# Altium schematic sheet RK3566_Power.SchDoc
size A2; SheetNumber: 3; SheetTotal: 6
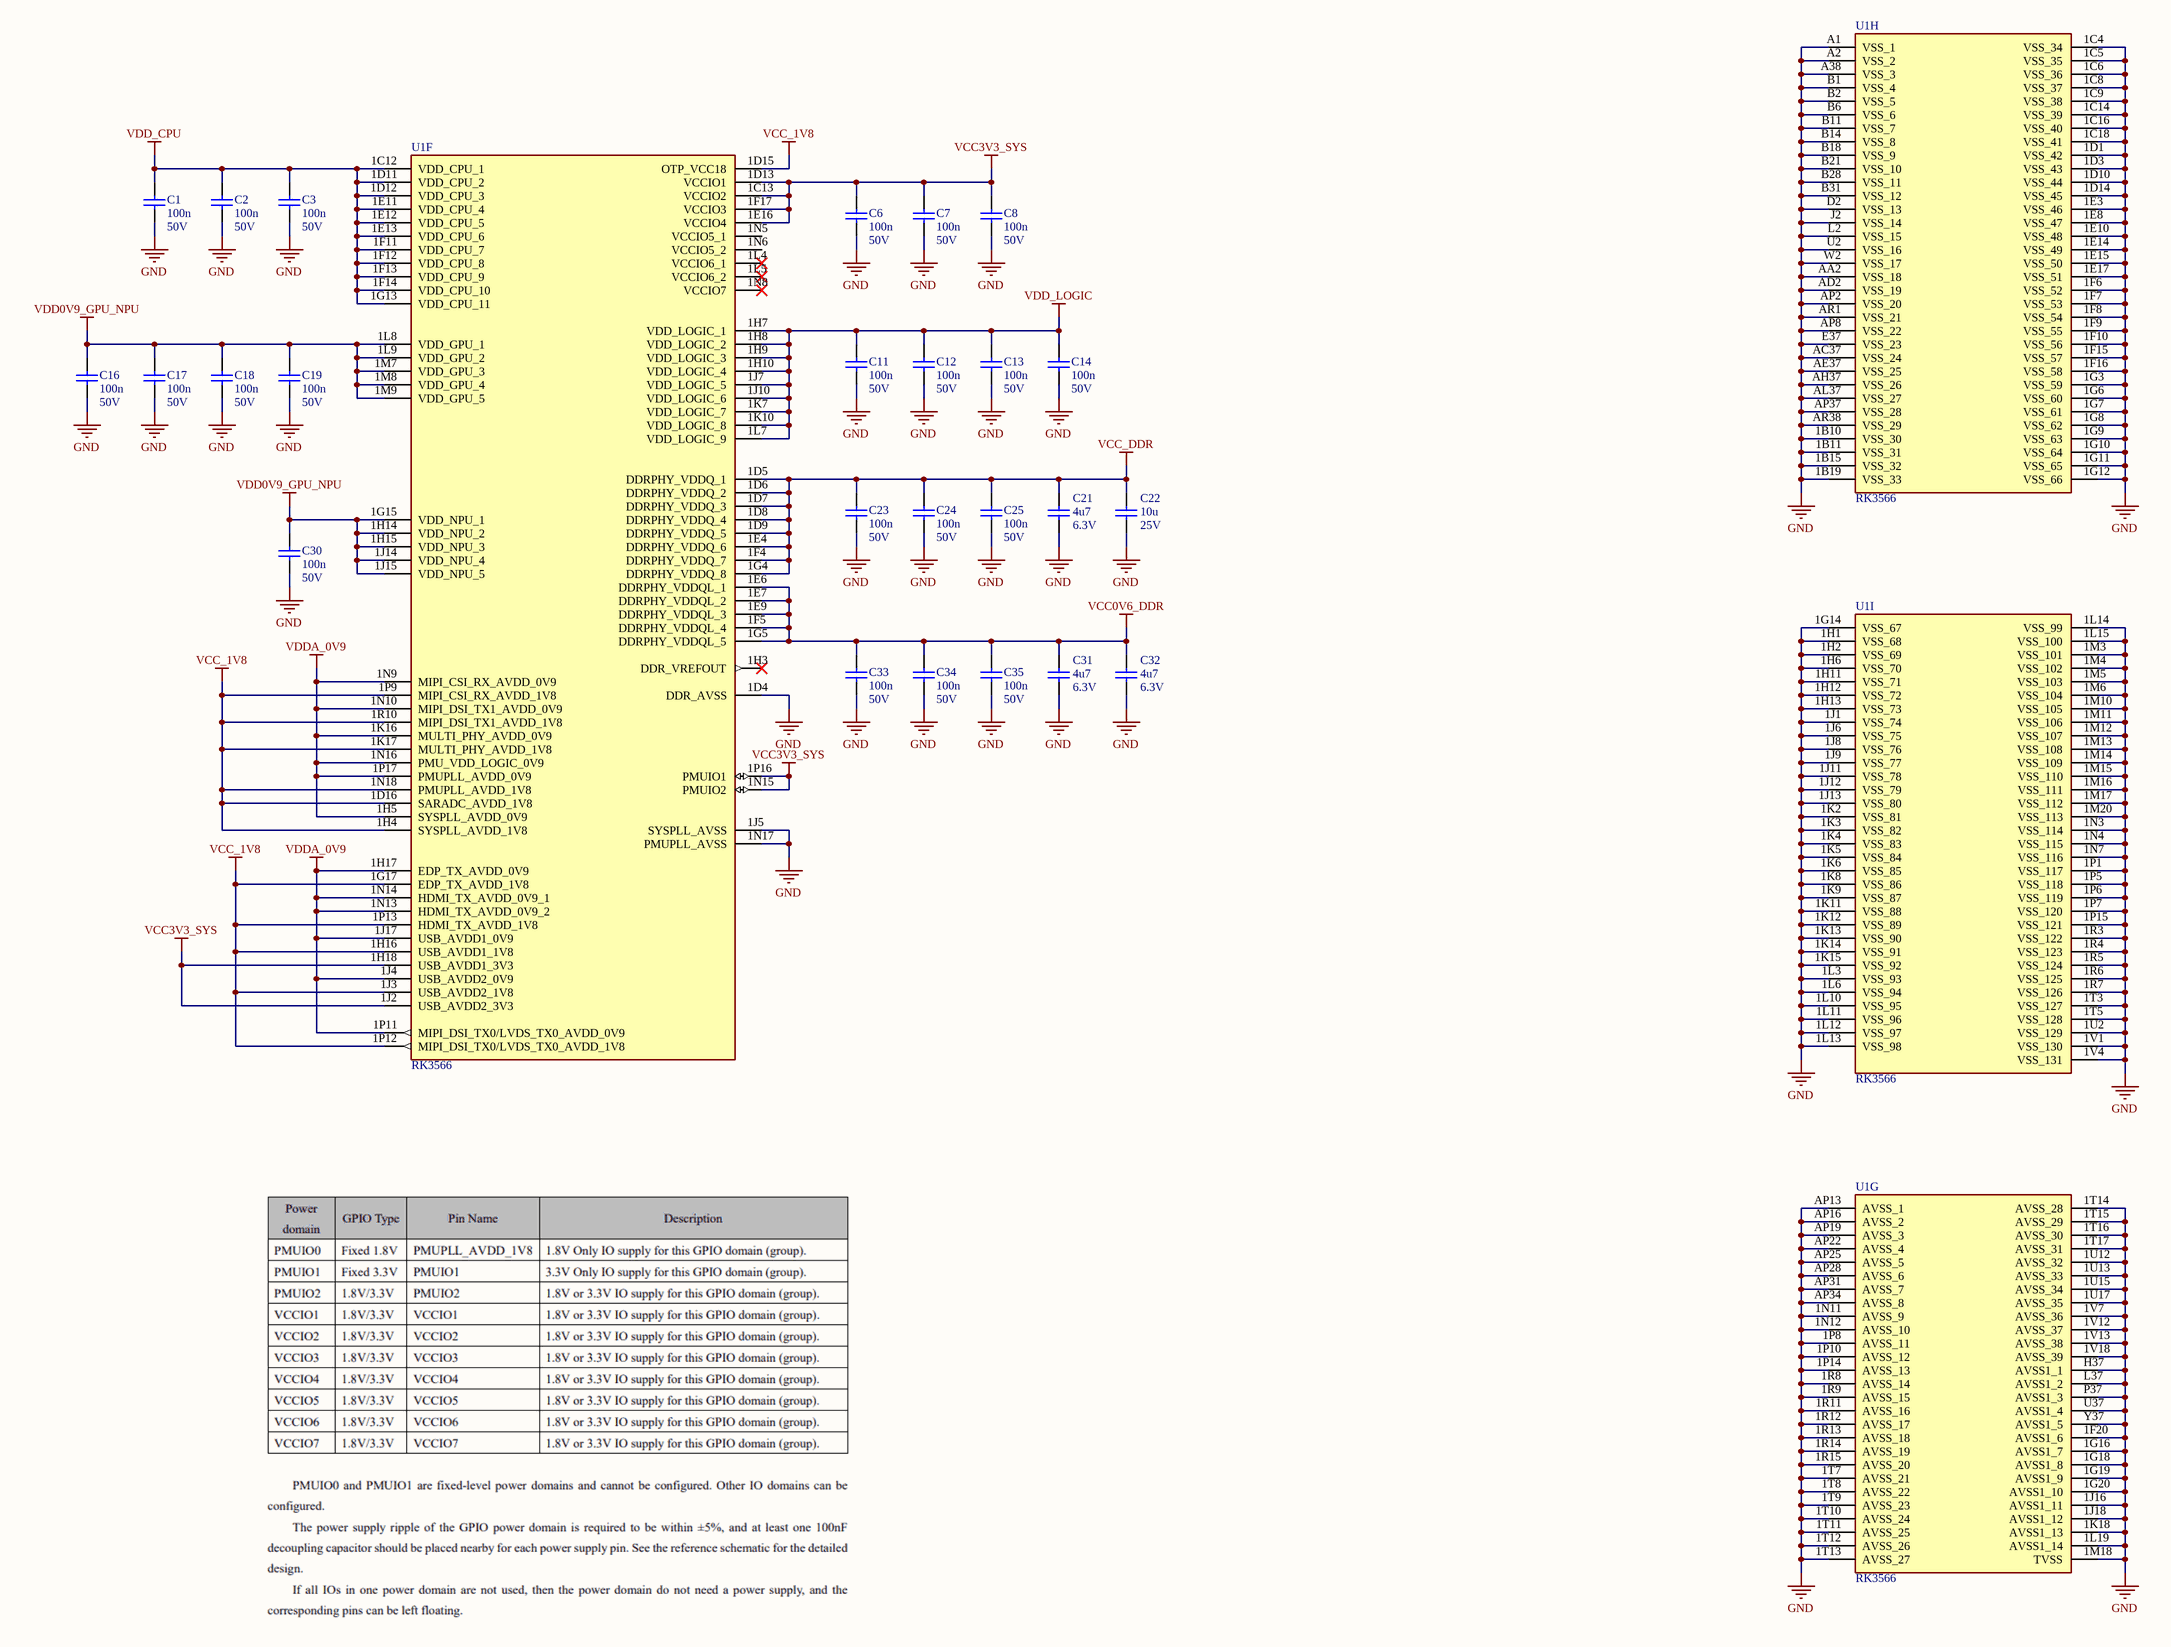
[diagram p0: RK3566_Power.SchDoc]

## Parts
C1  value 100n  Voltage: 50V  [GRM155R71H104KE14D]  (hidden comment: GRM155R71H104KE14D)
C2  value 100n  Voltage: 50V  [GRM155R71H104KE14D]  (hidden comment: GRM155R71H104KE14D)
C3  value 100n  Voltage: 50V  [GRM155R71H104KE14D]  (hidden comment: GRM155R71H104KE14D)
C6  value 100n  Voltage: 50V  [GRM155R71H104KE14D]  (hidden comment: GRM155R71H104KE14D)
C7  value 100n  Voltage: 50V  [GRM155R71H104KE14D]  (hidden comment: GRM155R71H104KE14D)
C8  value 100n  Voltage: 50V  [GRM155R71H104KE14D]  (hidden comment: GRM155R71H104KE14D)
C11  value 100n  Voltage: 50V  [GRM155R71H104KE14D]  (hidden comment: GRM155R71H104KE14D)
C12  value 100n  Voltage: 50V  [GRM155R71H104KE14D]  (hidden comment: GRM155R71H104KE14D)
C13  value 100n  Voltage: 50V  [GRM155R71H104KE14D]  (hidden comment: GRM155R71H104KE14D)
C14  value 100n  Voltage: 50V  [GRM155R71H104KE14D]  (hidden comment: GRM155R71H104KE14D)
C16  value 100n  Voltage: 50V  [GRM155R71H104KE14D]  (hidden comment: GRM155R71H104KE14D)
C17  value 100n  Voltage: 50V  [GRM155R71H104KE14D]  (hidden comment: GRM155R71H104KE14D)
C18  value 100n  Voltage: 50V  [GRM155R71H104KE14D]  (hidden comment: GRM155R71H104KE14D)
C19  value 100n  Voltage: 50V  [GRM155R71H104KE14D]  (hidden comment: GRM155R71H104KE14D)
C21  value 4u7  Voltage: 6.3V  [GRM155R60J475ME47D]  (hidden comment: GRM155R60J475ME47D)
C22  value 10u  Voltage: 25V  (hidden comment: GRM188R61E106MA73D)
C23  value 100n  Voltage: 50V  [GRM155R71H104KE14D]  (hidden comment: GRM155R71H104KE14D)
C24  value 100n  Voltage: 50V  [GRM155R71H104KE14D]  (hidden comment: GRM155R71H104KE14D)
C25  value 100n  Voltage: 50V  [GRM155R71H104KE14D]  (hidden comment: GRM155R71H104KE14D)
C30  value 100n  Voltage: 50V  [GRM155R71H104KE14D]  (hidden comment: GRM155R71H104KE14D)
C31  value 4u7  Voltage: 6.3V  [GRM155R60J475ME47D]  (hidden comment: GRM155R60J475ME47D)
C32  value 4u7  Voltage: 6.3V  [GRM155R60J475ME47D]  (hidden comment: GRM155R60J475ME47D)
C33  value 100n  Voltage: 50V  [GRM155R71H104KE14D]  (hidden comment: GRM155R71H104KE14D)
C34  value 100n  Voltage: 50V  [GRM155R71H104KE14D]  (hidden comment: GRM155R71H104KE14D)
C35  value 100n  Voltage: 50V  [GRM155R71H104KE14D]  (hidden comment: GRM155R71H104KE14D)
U1  RK3566  [RK3566]  (parts F,G,H,I of 9)

## Nets
GND: C1.2 C2.2 C3.2 C6.2 C7.2 C8.2 C11.2 C12.2 C13.2 C14.2 C16.2 C17.2 C18.2 C19.2 C21.2 C22.2 C23.2 C24.2 C25.2 C30.2 C31.2 C32.2 C33.2 C34.2 C35.2 U1.1B10(VSS_30) U1.1B11(VSS_31) U1.1B15(VSS_32) U1.1B19(VSS_33) U1.1C4(VSS_34) U1.1C5(VSS_35) U1.1C6(VSS_36) U1.1C8(VSS_37) U1.1C9(VSS_38) U1.1C14(VSS_39) U1.1C16(VSS_40) U1.1C18(VSS_41) U1.1D1(VSS_42) U1.1D3(VSS_43) U1.1D4(DDR_AVSS) U1.1D10(VSS_44) U1.1D14(VSS_45) U1.1E3(VSS_46) U1.1E8(VSS_47) U1.1E10(VSS_48) U1.1E14(VSS_49) U1.1E15(VSS_50) U1.1E17(VSS_51) U1.1F6(VSS_52) U1.1F7(VSS_53) U1.1F8(VSS_54) U1.1F9(VSS_55) U1.1F10(VSS_56) U1.1F15(VSS_57) U1.1F16(VSS_58) U1.1F20(AVSS1_6) U1.1G3(VSS_59) U1.1G6(VSS_60) U1.1G7(VSS_61) U1.1G8(VSS_62) U1.1G9(VSS_63) U1.1G10(VSS_64) U1.1G11(VSS_65) U1.1G12(VSS_66) U1.1G14(VSS_67) U1.1G16(AVSS1_7) U1.1G18(AVSS1_8) U1.1G19(AVSS1_9) U1.1G20(AVSS1_10) U1.1H1(VSS_68) U1.1H2(VSS_69) U1.1H6(VSS_70) U1.1H11(VSS_71) U1.1H12(VSS_72) U1.1H13(VSS_73) U1.1J1(VSS_74) U1.1J5(SYSPLL_AVSS) U1.1J6(VSS_75) U1.1J8(VSS_76) U1.1J9(VSS_77) U1.1J11(VSS_78) U1.1J12(VSS_79) U1.1J13(VSS_80) U1.1J16(AVSS1_11) U1.1J18(AVSS1_12) U1.1K2(VSS_81) U1.1K3(VSS_82) U1.1K4(VSS_83) U1.1K5(VSS_84) U1.1K6(VSS_85) U1.1K8(VSS_86) U1.1K9(VSS_87) U1.1K11(VSS_88) U1.1K12(VSS_89) U1.1K13(VSS_90) U1.1K14(VSS_91) U1.1K15(VSS_92) U1.1K18(AVSS1_13) U1.1L3(VSS_93) U1.1L6(VSS_94) U1.1L10(VSS_95) U1.1L11(VSS_96) U1.1L12(VSS_97) U1.1L13(VSS_98) U1.1L14(VSS_99) U1.1L15(VSS_100) U1.1L19(AVSS1_14) U1.1M3(VSS_101) U1.1M4(VSS_102) U1.1M5(VSS_103) U1.1M6(VSS_104) U1.1M10(VSS_105) U1.1M11(VSS_106) U1.1M12(VSS_107) U1.1M13(VSS_108) U1.1M14(VSS_109) U1.1M15(VSS_110) U1.1M16(VSS_111) U1.1M17(VSS_112) U1.1M18(TVSS) U1.1M20(VSS_113) U1.1N3(VSS_114) U1.1N4(VSS_115) U1.1N7(VSS_116) U1.1N11(AVSS_9) U1.1N12(AVSS_10) U1.1N17(PMUPLL_AVSS) U1.1P1(VSS_117) U1.1P5(VSS_118) U1.1P6(VSS_119) U1.1P7(VSS_120) U1.1P8(AVSS_11) U1.1P10(AVSS_12) U1.1P14(AVSS_13) U1.1P15(VSS_121) U1.1R3(VSS_122) U1.1R4(VSS_123) U1.1R5(VSS_124) U1.1R6(VSS_125) U1.1R7(VSS_126) U1.1R8(AVSS_14) U1.1R9(AVSS_15) U1.1R11(AVSS_16) U1.1R12(AVSS_17) U1.1R13(AVSS_18) U1.1R14(AVSS_19) U1.1R15(AVSS_20) U1.1T3(VSS_127) U1.1T5(VSS_128) U1.1T7(AVSS_21) U1.1T8(AVSS_22) U1.1T9(AVSS_23) U1.1T10(AVSS_24) U1.1T11(AVSS_25) U1.1T12(AVSS_26) U1.1T13(AVSS_27) U1.1T14(AVSS_28) U1.1T15(AVSS_29) U1.1T16(AVSS_30) U1.1T17(AVSS_31) U1.1U2(VSS_129) U1.1U12(AVSS_32) U1.1U13(AVSS_33) U1.1U15(AVSS_34) U1.1U17(AVSS_35) U1.1V1(VSS_130) U1.1V4(VSS_131) U1.1V7(AVSS_36) U1.1V12(AVSS_37) U1.1V13(AVSS_38) U1.1V18(AVSS_39) U1.A1(VSS_1) U1.A2(VSS_2) U1.A38(VSS_3) U1.AA2(VSS_18) U1.AC37(VSS_24) U1.AD2(VSS_19) U1.AE37(VSS_25) U1.AH37(VSS_26) U1.AL37(VSS_27) U1.AP2(VSS_20) U1.AP8(VSS_22) U1.AP13(AVSS_1) U1.AP16(AVSS_2) U1.AP19(AVSS_3) U1.AP22(AVSS_4) U1.AP25(AVSS_5) U1.AP28(AVSS_6) U1.AP31(AVSS_7) U1.AP34(AVSS_8) U1.AP37(VSS_28) U1.AR1(VSS_21) U1.AR38(VSS_29) U1.B1(VSS_4) U1.B2(VSS_5) U1.B6(VSS_6) U1.B11(VSS_7) U1.B14(VSS_8) U1.B18(VSS_9) U1.B21(VSS_10) U1.B28(VSS_11) U1.B31(VSS_12) U1.D2(VSS_13) U1.E37(VSS_23) U1.H37(AVSS1_1) U1.J2(VSS_14) U1.L2(VSS_15) U1.L37(AVSS1_2) U1.P37(AVSS1_3) U1.U2(VSS_16) U1.U37(AVSS1_4) U1.W2(VSS_17) U1.Y37(AVSS1_5)
VCC0V6_DDR: C31.1 C32.1 C33.1 C34.1 C35.1 U1.1E6(DDRPHY_VDDQL_1) U1.1E7(DDRPHY_VDDQL_2) U1.1E9(DDRPHY_VDDQL_3) U1.1F5(DDRPHY_VDDQL_4) U1.1G5(DDRPHY_VDDQL_5)
VCC3V3_SYS: C6.1 C7.1 C8.1 U1.1C13(VCCIO2) U1.1D13(VCCIO1) U1.1E16(VCCIO4) U1.1F17(VCCIO3) U1.1H18(USB_AVDD1_3V3) U1.1J2(USB_AVDD2_3V3) U1.1N15(PMUIO2) U1.1P16(PMUIO1)
VCC_1V8: U1.1D15(OTP_VCC18) U1.1D16(SARADC_AVDD_1V8) U1.1G17(EDP_TX_AVDD_1V8) U1.1H4(SYSPLL_AVDD_1V8) U1.1H16(USB_AVDD1_1V8) U1.1J3(USB_AVDD2_1V8) U1.1K17(MULTI_PHY_AVDD_1V8) U1.1N18(PMUPLL_AVDD_1V8) U1.1P9(MIPI_CSI_RX_AVDD_1V8) U1.1P12(MIPI_DSI_TX0/LVDS_TX0_AVDD_1V8) U1.1P13(HDMI_TX_AVDD_1V8) U1.1R10(MIPI_DSI_TX1_AVDD_1V8)
VCC_DDR: C21.1 C22.1 C23.1 C24.1 C25.1 U1.1D5(DDRPHY_VDDQ_1) U1.1D6(DDRPHY_VDDQ_2) U1.1D7(DDRPHY_VDDQ_3) U1.1D8(DDRPHY_VDDQ_4) U1.1D9(DDRPHY_VDDQ_5) U1.1E4(DDRPHY_VDDQ_6) U1.1F4(DDRPHY_VDDQ_7) U1.1G4(DDRPHY_VDDQ_8)
VDD0V9_GPU_NPU: C16.1 C17.1 C18.1 C19.1 C30.1 U1.1G15(VDD_NPU_1) U1.1H14(VDD_NPU_2) U1.1H15(VDD_NPU_3) U1.1J14(VDD_NPU_4) U1.1J15(VDD_NPU_5) U1.1L8(VDD_GPU_1) U1.1L9(VDD_GPU_2) U1.1M7(VDD_GPU_3) U1.1M8(VDD_GPU_4) U1.1M9(VDD_GPU_5)
VDD_CPU: C1.1 C2.1 C3.1 U1.1C12(VDD_CPU_1) U1.1D11(VDD_CPU_2) U1.1D12(VDD_CPU_3) U1.1E11(VDD_CPU_4) U1.1E12(VDD_CPU_5) U1.1E13(VDD_CPU_6) U1.1F11(VDD_CPU_7) U1.1F12(VDD_CPU_8) U1.1F13(VDD_CPU_9) U1.1F14(VDD_CPU_10) U1.1G13(VDD_CPU_11)
VDD_LOGIC: C11.1 C12.1 C13.1 C14.1 U1.1H7(VDD_LOGIC_1) U1.1H8(VDD_LOGIC_2) U1.1H9(VDD_LOGIC_3) U1.1H10(VDD_LOGIC_4) U1.1J7(VDD_LOGIC_5) U1.1J10(VDD_LOGIC_6) U1.1K7(VDD_LOGIC_7) U1.1K10(VDD_LOGIC_8) U1.1L7(VDD_LOGIC_9)
VDDA_0V9: U1.1H5(SYSPLL_AVDD_0V9) U1.1H17(EDP_TX_AVDD_0V9) U1.1J4(USB_AVDD2_0V9) U1.1J17(USB_AVDD1_0V9) U1.1K16(MULTI_PHY_AVDD_0V9) U1.1N9(MIPI_CSI_RX_AVDD_0V9) U1.1N10(MIPI_DSI_TX1_AVDD_0V9) U1.1N13(HDMI_TX_AVDD_0V9_2) U1.1N14(HDMI_TX_AVDD_0V9_1) U1.1N16(PMU_VDD_LOGIC_0V9) U1.1P11(MIPI_DSI_TX0/LVDS_TX0_AVDD_0V9) U1.1P17(PMUPLL_AVDD_0V9)

Not connected (* = marked no-connect by the designer): U1 1H3(DDR_VREFOUT)* 1L4(VCCIO6_1)* 1L5(VCCIO6_2)* 1N5(VCCIO5_1) 1N6(VCCIO5_2) 1N8(VCCIO7)*

## Library data of the parts
C1-C3 C6-C8 C11-C14 C16-C19 C23-C25 C30 C33-C35 = GRM155R71H104KE14D: CAP 100N 50V X7R 0402; Size: 0402; Dielectric: X7R; Manufacturer Part Number 1: GRM155R71H104KE14D
C21 C31 C32 = GRM155R60J475ME47D: CAP 4.7U 6.3V X5R 0402; Size: 0402; Dielectric: X5R; Manufacturer Part Number 1: GRM155R60J475ME47D
C22 = GRM188R61E106MA73D: CAP 10U 25V X5R 0603; Size: 0603; Dielectric: X5R
U1 = RK3566: high-performance and low-power quad-core application processor; MF: Fuzhou Rockchip Electronics Co; SnapEDA_Link: https://www.snapeda.com/parts/RK3566/Fuzhou+Rockchip+Electronics+Co/view-part/?ref=snap; Package: None; Value: *; MP: RK3566; Check_prices: https://www.snapeda.com/parts/RK3566/Fuzhou+Rockchip+Electronics+Co/view-part/?ref=eda